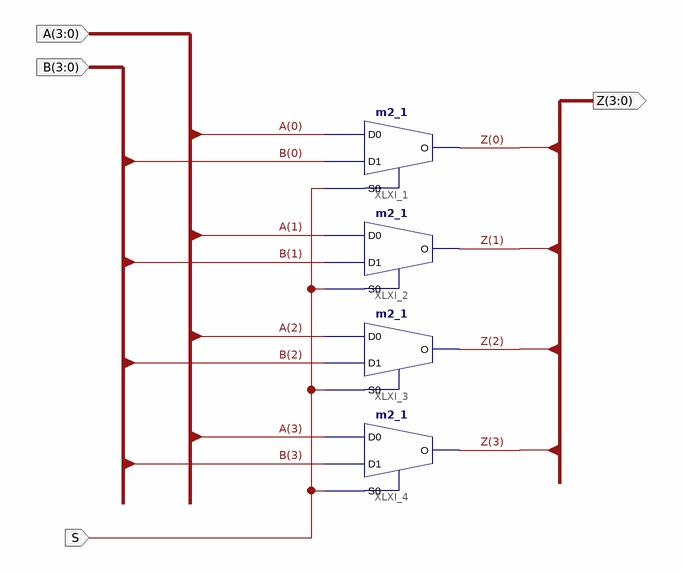
[diagram p0: schematic sheet 1]
// Xilinx ISE schematic Mux4Bit2In.sch (spartan6) as structural Verilog: 4 symbols, 4 ports
module Mux4Bit2In (
  input  S,
  input  [3:0] B,
  input  [3:0] A,
  output [3:0] Z
);

  m2_1 XLXI_1 (.D0(A[0]), .D1(B[0]), .S0(S), .O(Z[0]));
  m2_1 XLXI_2 (.D0(A[1]), .D1(B[1]), .S0(S), .O(Z[1]));
  m2_1 XLXI_3 (.D0(A[2]), .D1(B[2]), .S0(S), .O(Z[2]));
  m2_1 XLXI_4 (.D0(A[3]), .D1(B[3]), .S0(S), .O(Z[3]));
endmodule
